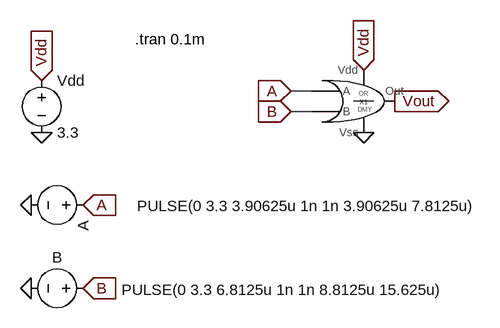
[diagram p0: schematic OR_test.asc]
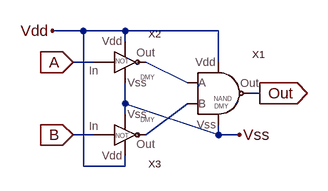
[diagram p1: sub-circuit or.asc]
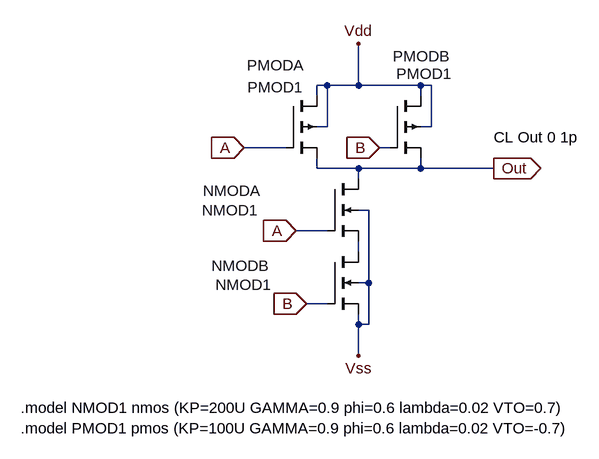
[diagram p2: sub-circuit nand.asc]
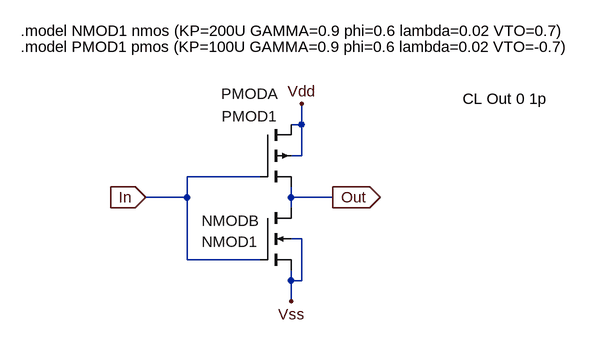
[diagram p3: sub-circuit not.asc]
OR_test.asc, the LTspice schematic file:
Version 4
SHEET 1 880 920
WIRE 224 128 192 128
WIRE 320 144 288 144
WIRE 224 160 192 160
FLAG 304 192 0
FLAG -192 192 0
FLAG -208 304 0
FLAG -128 304 A
IOPIN -128 304 In
FLAG 192 160 B
IOPIN 192 160 In
FLAG 192 128 A
IOPIN 192 128 In
FLAG -128 432 B
IOPIN -128 432 In
FLAG -192 112 Vdd
IOPIN -192 112 In
FLAG 304 96 Vdd
IOPIN 304 96 In
FLAG 352 144 Vout
IOPIN 352 144 Out
FLAG -208 432 0
SYMBOL voltage -192 96 R0
WINDOW 123 0 0 Left 0
WINDOW 39 0 0 Left 0
SYMATTR InstName Vdd
SYMATTR Value 3.3
SYMBOL voltage -112 304 R90
WINDOW 3 1 -594 VRight 2
WINDOW 123 0 0 Left 0
WINDOW 39 0 0 Left 0
SYMATTR Value PULSE(0 3.3 3.90625u 1n 1n 3.90625u 7.8125u)
SYMATTR InstName A
SYMBOL voltage -112 432 R90
WINDOW 0 -32 56 VBottom 2
WINDOW 3 -13 -293 VTop 2
WINDOW 123 0 0 Left 0
WINDOW 39 0 0 Left 0
SYMATTR InstName B
SYMATTR Value PULSE(0 3.3 6.8125u 1n 1n 8.8125u 15.625u)
SYMBOL OR 240 144 R0
SYMATTR InstName X1
TEXT -48 48 Left 2 !.tran 0.1m

or.asc, the sub-circuit schematic file:
Version 4
SHEET 1 880 680
WIRE 48 64 0 64
WIRE 112 64 48 64
WIRE 256 64 112 64
WIRE 112 80 112 64
WIRE 64 112 32 112
WIRE 256 112 256 64
WIRE 208 144 144 112
WIRE 320 160 304 160
WIRE 112 176 112 144
WIRE 112 192 112 176
WIRE 64 224 32 224
WIRE 144 224 208 176
WIRE 256 224 112 176
WIRE 256 224 256 208
WIRE 288 224 256 224
WIRE 48 272 48 64
WIRE 112 272 112 256
WIRE 112 272 48 272
FLAG 32 112 A
IOPIN 32 112 In
FLAG 32 224 B
IOPIN 32 224 In
FLAG 320 160 Out
IOPIN 320 160 Out
FLAG 0 64 Vdd
FLAG 288 224 Vss
SYMBOL NAND 224 160 R0
SYMATTR InstName X1
SYMBOL NOT 96 112 R0
SYMATTR InstName X2
SYMBOL NOT 96 224 M180
SYMATTR InstName X3

nand.asc, the sub-circuit schematic file:
Version 4
SHEET 1 880 680
WIRE 272 -32 256 -32
WIRE 320 -32 320 -96
WIRE 320 -32 272 -32
WIRE 416 -32 320 -32
WIRE 432 -32 416 -32
WIRE 256 -16 256 -32
WIRE 416 -16 416 -32
WIRE 272 32 272 -32
WIRE 272 32 256 32
WIRE 432 32 432 -32
WIRE 432 32 416 32
WIRE 208 64 144 64
WIRE 368 64 352 64
WIRE 256 96 256 80
WIRE 320 96 256 96
WIRE 416 96 416 80
WIRE 416 96 320 96
WIRE 528 96 416 96
WIRE 320 112 320 96
WIRE 336 160 320 160
WIRE 272 192 224 192
WIRE 320 224 320 208
WIRE 336 272 336 160
WIRE 336 272 320 272
WIRE 272 304 240 304
WIRE 320 336 320 320
WIRE 336 336 336 272
WIRE 336 336 320 336
WIRE 320 384 320 336
FLAG 144 64 A
IOPIN 144 64 In
FLAG 224 192 A
IOPIN 224 192 In
FLAG 352 64 B
IOPIN 352 64 In
FLAG 240 304 B
IOPIN 240 304 In
FLAG 528 96 Out
IOPIN 528 96 Out
FLAG 320 384 Vss
FLAG 320 -96 Vdd
SYMBOL pmos4 208 -16 R0
WINDOW 0 -60 -47 Left 2
WINDOW 3 -59 -13 Left 2
SYMATTR InstName PMODA
SYMATTR Value PMOD1
SYMATTR Value2 l=1u w=50u
SYMBOL pmos4 368 -16 R0
WINDOW 0 5 -61 Left 2
WINDOW 3 10 -34 Left 2
SYMATTR InstName PMODB
SYMATTR Value PMOD1
SYMATTR Value2 l=1u w=50u
SYMBOL nmos4 272 112 R0
WINDOW 0 -191 18 Left 2
WINDOW 3 -193 48 Left 2
SYMATTR InstName NMODA
SYMATTR Value NMOD1
SYMATTR Value2 l=1u w=50u
SYMBOL nmos4 272 224 R0
WINDOW 0 -178 22 Left 2
WINDOW 3 -172 51 Left 2
SYMATTR InstName NMODB
SYMATTR Value NMOD1
SYMATTR Value2 l=1u w=100u
TEXT -200 464 Left 2 !.model NMOD1 nmos (KP=200U GAMMA=0.9 phi=0.6 lambda=0.02 VTO=0.7)
TEXT -200 496 Left 2 !.model PMOD1 pmos (KP=100U GAMMA=0.9 phi=0.6 lambda=0.02 VTO=-0.7)
TEXT 528 48 Left 2 !CL Out 0 1p

not.asc, the sub-circuit schematic file:
Version 4
SHEET 1 880 680
WIRE 288 -96 288 -128
WIRE 288 -96 272 -96
WIRE 288 -48 288 -96
WIRE 288 -48 272 -48
WIRE 224 -16 112 -16
WIRE 112 16 112 -16
WIRE 112 16 48 16
WIRE 272 16 272 0
WIRE 336 16 272 16
WIRE 272 32 272 16
WIRE 112 112 112 16
WIRE 288 80 272 80
WIRE 224 112 112 112
WIRE 272 144 272 128
WIRE 288 144 288 80
WIRE 288 144 272 144
WIRE 272 176 272 144
FLAG 48 16 In
IOPIN 48 16 In
FLAG 336 16 Out
IOPIN 336 16 Out
FLAG 272 176 Vss
FLAG 288 -128 Vdd
SYMBOL pmos4 224 -96 R0
WINDOW 0 -60 -47 Left 2
WINDOW 3 -59 -13 Left 2
SYMATTR InstName PMODA
SYMATTR Value PMOD1
SYMATTR Value2 l=1u w=50u
SYMBOL nmos4 224 32 R0
WINDOW 0 -90 20 Left 2
WINDOW 3 -90 52 Left 2
SYMATTR InstName NMODB
SYMATTR Value NMOD1
SYMATTR Value2 l=1u w=100u
TEXT -144 -240 Left 2 !.model NMOD1 nmos (KP=200U GAMMA=0.9 phi=0.6 lambda=0.02 VTO=0.7)
TEXT -144 -216 Left 2 !.model PMOD1 pmos (KP=100U GAMMA=0.9 phi=0.6 lambda=0.02 VTO=-0.7)
TEXT 536 -136 Left 2 !CL Out 0 1p

The netlist it stands for:
* OR_test.asc
Vdd Vdd 0 3.3
V§A A 0 PULSE(0 3.3 3.90625u 1n 1n 3.90625u 7.8125u)
V§B B 0 PULSE(0 3.3 6.8125u 1n 1n 8.8125u 15.625u)
XX1 Vdd 0 Vout A B or

* block symbol definitions
.subckt or Vdd Vss Out A B
XX1 N001 N002 Out Vss Vdd nand
XX2 Vdd Vss A N001 not
XX3 Vdd Vss B N002 not
.ends or

.subckt nand A B Out Vss Vdd
M§PMODA Vdd A Out Vdd PMOD1 l=1u w=50u
M§PMODB Vdd B Out Vdd PMOD1 l=1u w=50u
M§NMODA Out A N001 Vss NMOD1 l=1u w=50u
M§NMODB N001 B Vss Vss NMOD1 l=1u w=100u
.model NMOD1 nmos (KP=200U GAMMA=0.9 phi=0.6 lambda=0.02 VTO=0.7)
.model PMOD1 pmos (KP=100U GAMMA=0.9 phi=0.6 lambda=0.02 VTO=-0.7)
CL Out 0 1p
.ends nand

.subckt not Vdd Vss In Out
M§PMODA Vdd In Out Vdd PMOD1 l=1u w=50u
M§NMODB Out In Vss Vss NMOD1 l=1u w=100u
.model NMOD1 nmos (KP=200U GAMMA=0.9 phi=0.6 lambda=0.02 VTO=0.7)
.model PMOD1 pmos (KP=100U GAMMA=0.9 phi=0.6 lambda=0.02 VTO=-0.7)
CL Out 0 1p
.ends not

.model NMOS NMOS
.model PMOS PMOS
.lib standard.mos
.tran 0.1m
.backanno
.end

* Results of the author's LTspice run, read from the files saved beside the schematic
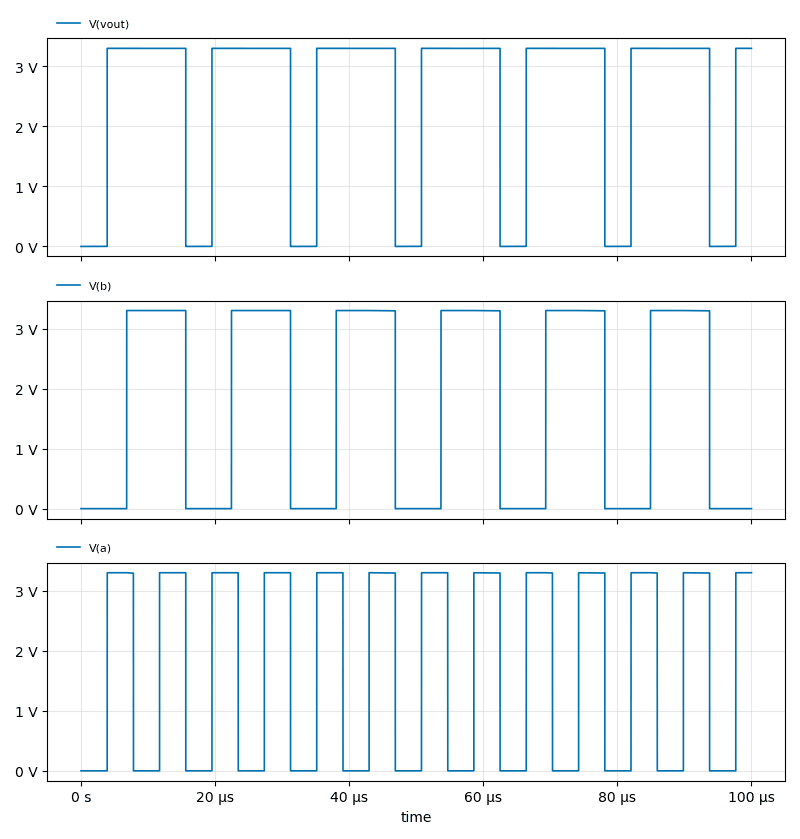
[diagram p4: Transient Analysis of OR_test.asc, plotted from the saved traces]
* Transient Analysis, 1 run:
*   V(vout): min 0 V, max 3.3 V, average 2.398 V, rms 2.813 V, last 3.3 V
*   V(b): min 0 V, max 3.3 V, average 1.745 V, rms 2.399 V, last 0 V
*   V(a): min 0 V, max 3.3 V, average 1.624 V, rms 2.315 V, last 3.3 V